# EAGLE design Power_Distro_Board_V6 (EAGLE 8.3.2)
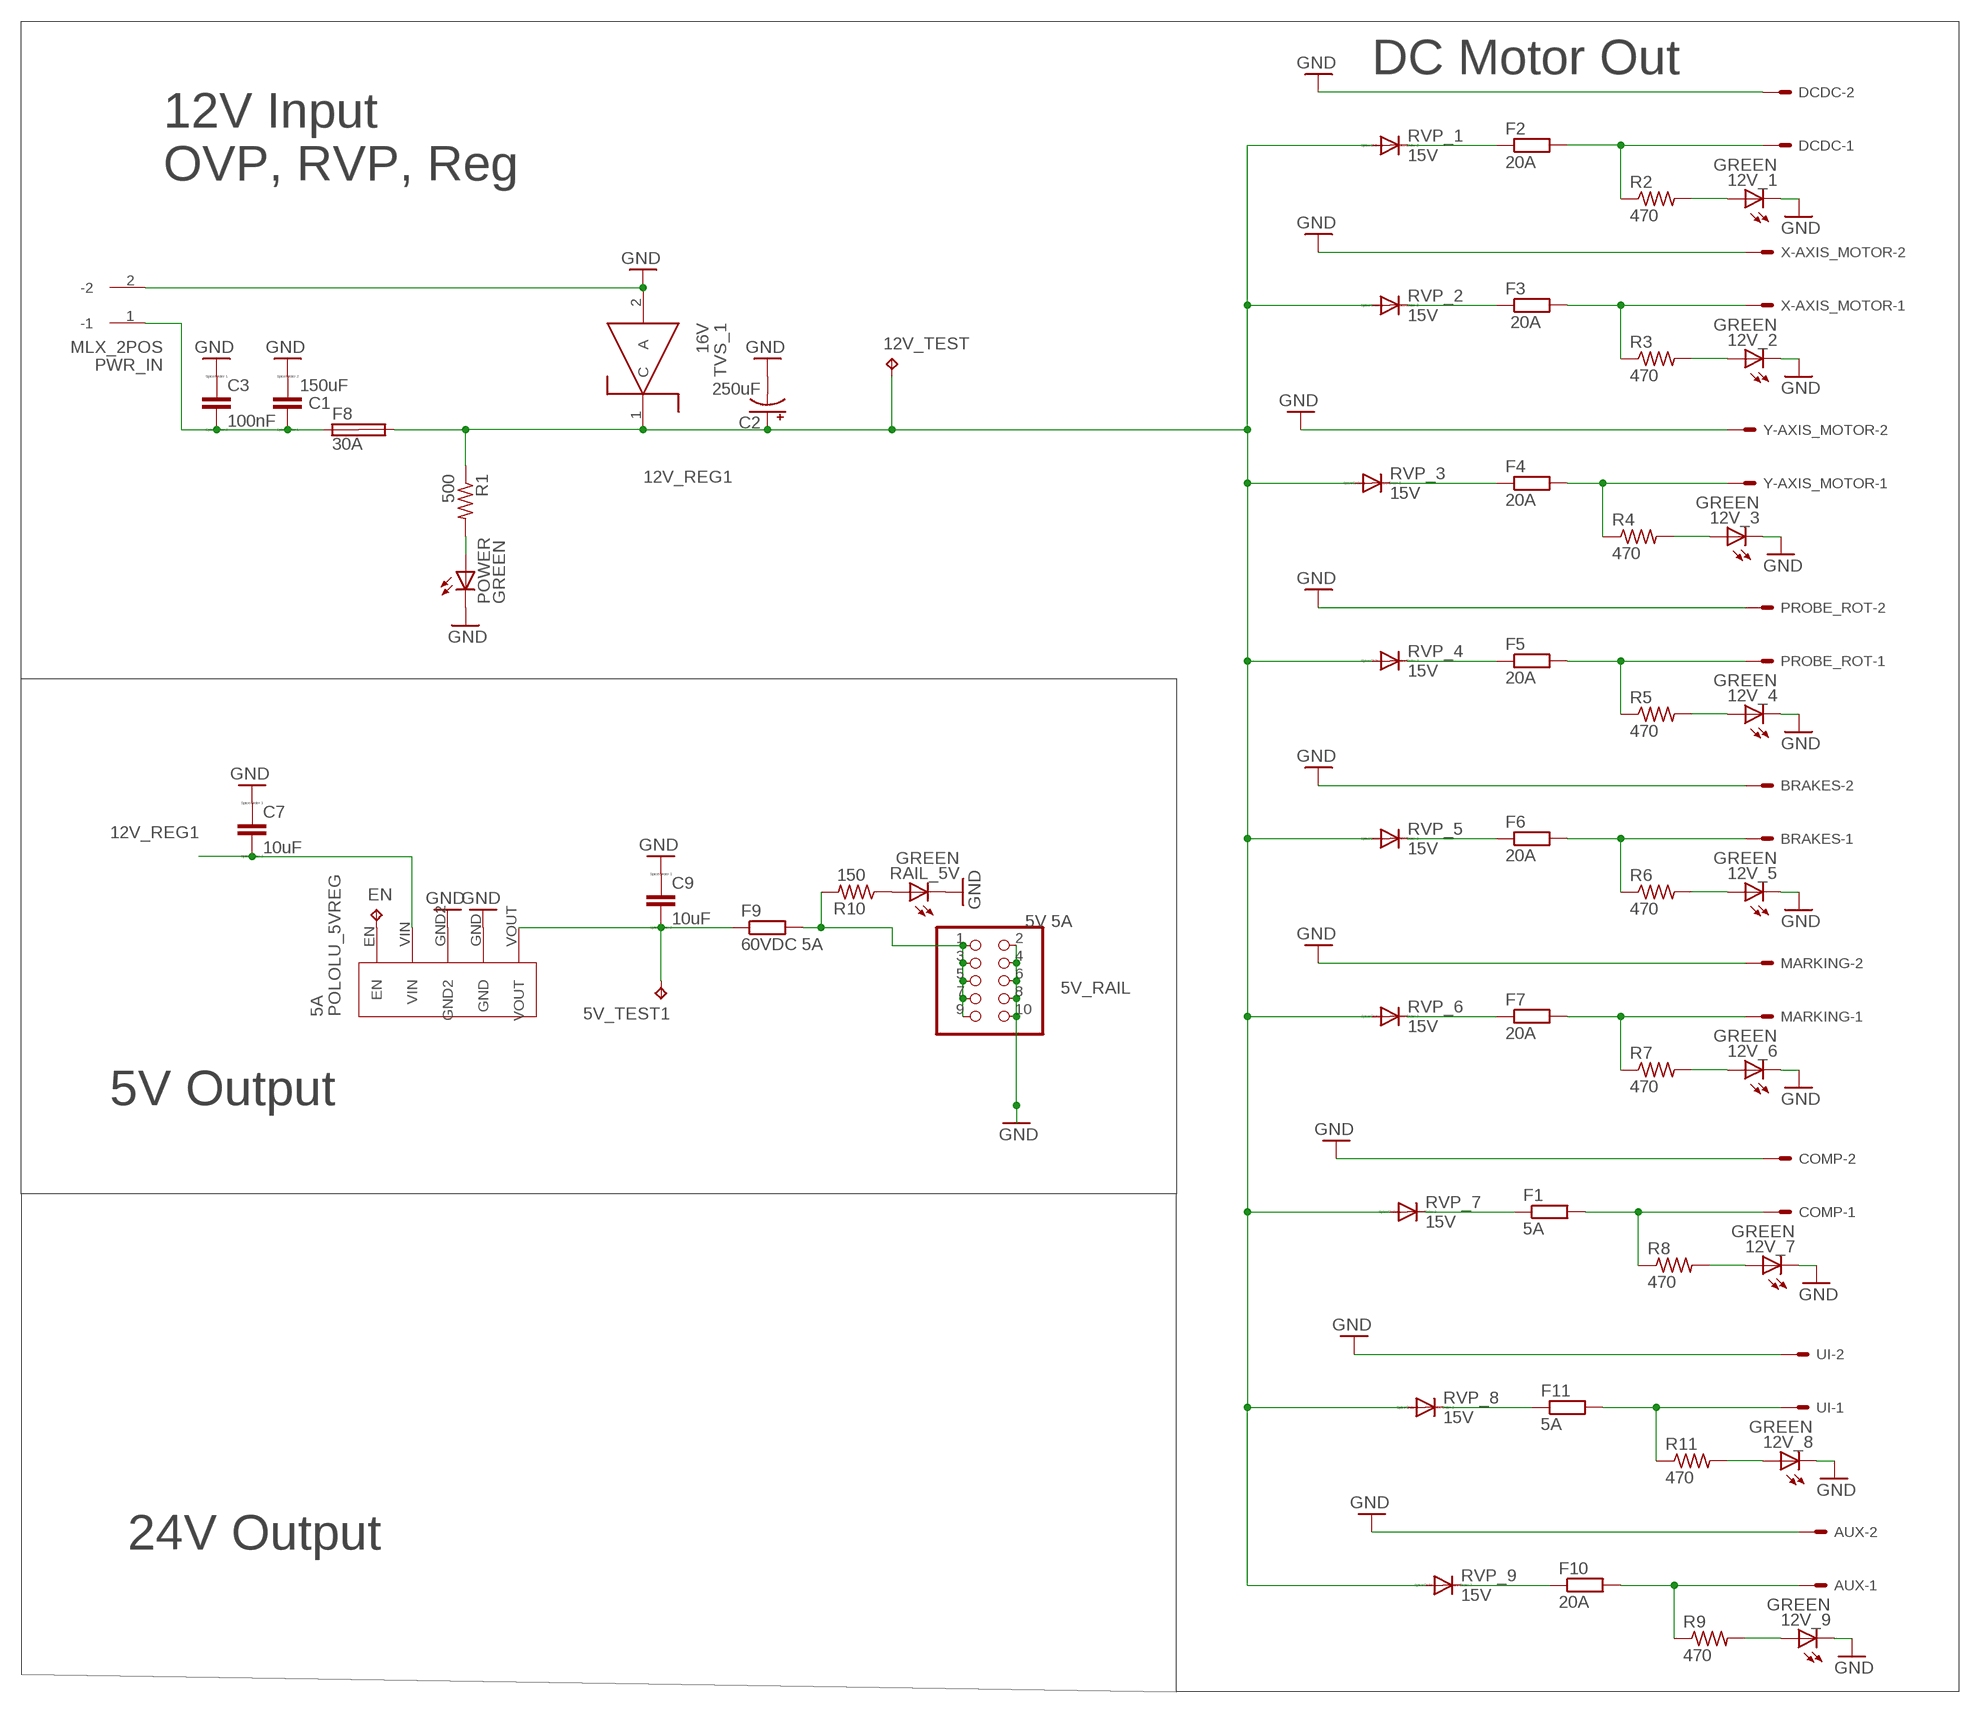
[diagram p0: schematic, sheet 1]

## Parts
5A  POLOLU_5VREG  [SIP5]
5V_RAIL  5V 5A  PINHD-2X5  [2X05]
5V_TEST1  TPPAD1-13  [P1-13]
12V_1  GREEN  LEDSML1206  [SML1206]
12V_2  GREEN  LEDSML1206  [SML1206]
12V_3  GREEN  LEDSML1206  [SML1206]
12V_4  GREEN  LEDSML1206  [SML1206]
12V_5  GREEN  LEDSML1206  [SML1206]
12V_6  GREEN  LEDSML1206  [SML1206]
12V_7  GREEN  LEDSML1206  [SML1206]
12V_8  GREEN  LEDSML1206  [SML1206]
12V_9  GREEN  LEDSML1206  [SML1206]
12V_TEST  TPPAD1-13  [P1-13]
AUX  555X-2V  [5566-2]
BRAKES  555X-2V  [5566-2]
C1  150uF  CC1210  [C1210]
C2  250uF  ALUM_ELEC_RADIAL  [CPOL-RADIAL-5MM-10MM]
C3  100nF  CC1210  [C1210]
C7  10uF  CC1210  [C1210]
C9  10uF  CC1210  [C1210]
COMP  555X-2V  [5566-2]
DCDC  555X-2V  [5566-2]
EN  TPPAD1-13  [P1-13]
F1  5A  R-EU_M1206  [M1206]
F2  20A  R-EU_M1206  [M1206]
F3  20A  R-EU_M1206  [M1206]
F4  20A  R-EU_M1206  [M1206]
F5  20A  R-EU_M1206  [M1206]
F6  20A  R-EU_M1206  [M1206]
F7  20A  R-EU_M1206  [M1206]
F8  30A  SHK20L  [SHK20L]
F9  60VDC 5A  R-EU_M1206  [M1206]
F10  20A  R-EU_M1206  [M1206]
F11  5A  R-EU_M1206  [M1206]
MARKING  555X-2V  [5566-2]
POWER  GREEN  LEDSML1206  [SML1206]
PROBE_ROT  555X-2V  [5566-2]
PWR_IN  MLX_2POS  [.084MLX]
R1  500  R-US_R1206  [R1206]
R2  470  R-US_R1206  [R1206]
R3  470  R-US_R1206  [R1206]
R4  470  R-US_R1206  [R1206]
R5  470  R-US_R1206  [R1206]
R6  470  R-US_R1206  [R1206]
R7  470  R-US_R1206  [R1206]
R8  470  R-US_R1206  [R1206]
R9  470  R-US_R1206  [R1206]
R10  150  R-US_R1206  [R1206]
R11  470  R-US_R1206  [R1206]
RAIL_5V  GREEN  LEDSML1206  [SML1206]
RVP_1  15V  BYT08P  [TO220ACS]
RVP_2  15V  BYT08P  [TO220ACS]
RVP_3  15V  BYT08P  [TO220ACS]
RVP_4  15V  BYT08P  [TO220ACS]
RVP_5  15V  BYT08P  [TO220ACS]
RVP_6  15V  BYT08P  [TO220ACS]
RVP_7  15V  BYT08P  [TO220ACS]
RVP_8  15V  BYT08P  [TO220ACS]
RVP_9  15V  BYT08P  [TO220ACS]
TVS_1  16V  SMAJ26A_TVSSMA  [DO-214AC]
UI  555X-2V  [5566-2]
X-AXIS_MOTOR  555X-2V  [5566-2]
Y-AXIS_MOTOR  555X-2V  [5566-2]

## Nets
5V_REG3: 5V_RAIL.1 5V_RAIL.3 5V_RAIL.5 5V_RAIL.7 5V_RAIL.9 F9.2 R10.2
12V_REG1: 5A.VIN 12V_TEST.TP C2.+ C7.2 F8.2A R1.1 RVP_1.A RVP_2.A RVP_3.A RVP_4.A RVP_5.A RVP_6.A RVP_7.A RVP_8.A RVP_9.A TVS_1.1(C)
GND: 5A.GND 5A.GND2 5V_RAIL.2 5V_RAIL.4 5V_RAIL.6 5V_RAIL.8 5V_RAIL.10 12V_1.C 12V_2.C 12V_3.C 12V_4.C 12V_5.C 12V_6.C 12V_7.C 12V_8.C 12V_9.C AUX.2 BRAKES.2 C1.2 C2.- C3.1 C7.1 C9.1 COMP.2 DCDC.2 MARKING.2 POWER.C PROBE_ROT.2 PWR_IN.2(-2) RAIL_5V.C TVS_1.2(A) UI.2 X-AXIS_MOTOR.2 Y-AXIS_MOTOR.2
N$1: POWER.A R1.2
N$3: C1.1 C3.2 F8.1A PWR_IN.1(-1)
N$4: F1.1 RVP_7.C
N$5: F2.1 RVP_1.C
N$7: F6.1 RVP_5.C
N$8: 5A.EN EN.TP
N$9: 12V_1.A R2.2
N$10: F10.1 RVP_9.C
N$11: R10.1 RAIL_5V.A
N$12: DCDC.1 F2.2 R2.1
N$13: 12V_5.A R6.2
N$14: F3.1 RVP_2.C
N$15: 12V_9.A R9.2
N$16: 12V_2.A R3.2
N$17: BRAKES.1 F6.2 R6.1
N$18: F3.2 R3.1 X-AXIS_MOTOR.1
N$20: F7.1 RVP_6.C
N$21: 12V_6.A R7.2
N$22: F4.1 RVP_3.C
N$23: F7.2 MARKING.1 R7.1
N$24: 12V_3.A R4.2
N$25: F4.2 R4.1 Y-AXIS_MOTOR.1
N$26: F5.1 RVP_4.C
N$27: 12V_4.A R5.2
N$28: F5.2 PROBE_ROT.1 R5.1
N$29: 12V_7.A R8.2
N$30: COMP.1 F1.2 R8.1
N$31: F11.1 RVP_8.C
N$32: 5A.VOUT 5V_TEST1.TP C9.2 F9.1
N$33: 12V_8.A R11.2
N$34: F11.2 R11.1 UI.1
N$35: AUX.1 F10.2 R9.1
Unconnected: F8.1B F8.2B

## Notes on the sheet
- DC Motor Out
- 12V Input 
  OVP, RVP, Reg
- 5V Output
- 24V Output

## Library data of the parts
5A = POWER_DISTRO:POLOLU_5VREG: Pololu 5V Regulator Variable Output Current
5V_RAIL = pinhead:PINHD-2X5: PIN HEADER
5V_TEST1 12V_TEST EN = testpad:TP: Test pad
12V_1-12V_9 POWER RAIL_5V = led:LED: LED OSRAM: - CHIPLED LG R971, LG N971, LY N971, LG Q971, LY Q971, LO R971, LY R971 LH N974, LH R974 LS Q976, LO Q976, LY Q976 LO Q996 - Hyper CHIPLED LW Q18S LB Q993, LB Q99A, LB R99A - SideLED LS A670, LO A670, LY A670, LG A670, LP A670 LB A673, LV A673, LT A673, LW A673 LH A674 LY A675 LS A676, LA A676, LO A676, LY A676, LW A676 LS A679, LY A679, LG A679 - Hyper Micro SIDELED® LS Y876, LA Y876, LO Y876, LY Y876 LT Y87S - SmartLED LW L88C, LW L88S LB L89C, LB L89S, LG L890 LS L89K, LO L89K, LY L89K LS L896, LA L896, LO L896, LY L896 - TOPLED LS T670, LO T670, LY T670, LG T670, LP T670 LSG T670, LSP T670, LSY T670, LOP T670, LYG T670 LG T671, LOG T671, LSG T671 LB T673, LV T673, LT T673, LW T673 LH T674 LS T676, LA T676, LO T676, LY T676, LB T676, LH T676, LSB T676, LW T676 LB T67C, LV T67C, LT T67C, LS T67K, LO T67K, LY T67K, LW E67C LS E67B, LA E67B, LO E67B, LY E67B, LB E67C, LV E67C, LT E67C LW T67C LS T679, LY T679, LG T679 LS T770, LO T770, LY T770, LG T770, LP T770 LB T773, LV T773, LT T773, LW T773 LH T774 LS E675, LA E675, LY E675, LS T675 LS T776, LA T776, LO T776, LY T776, LB T776 LHGB T686 LT T68C, LB T68C - Hyper Mini TOPLED® LB M676 - Mini TOPLED Santana® LG M470 LS M47K, LO M47K, LY M47K Source: http://www.osram.convergy.de LUXEON: - LUMILED® LXK2-PW12-R00, LXK2-PW12-S00, LXK2-PW14-U00, LXK2-PW14-V00 LXK2-PM12-R00, LXK2-PM12-S00, LXK2-PM14-U00 LXK2-PE12-Q00, LXK2-PE12-R00, LXK2-PE12-S00, LXK2-PE14-T00, LXK2-PE14-U00 LXK2-PB12-K00, LXK2-PB12-L00, LXK2-PB12-M00, LXK2-PB14-N00, LXK2-PB14-P00, LXK2-PB14-Q00 LXK2-PR12-L00, LXK2-PR12-M00, LXK2-PR14-Q00, LXK2-PR14-R00 LXK2-PD12-Q00, LXK2-PD12-R00, LXK2-PD12-S00 LXK2-PH12-R00, LXK2-PH12-S00 LXK2-PL12-P00, LXK2-PL12-Q00, LXK2-PL12-R00 Source: www.luxeon.com KINGBRIGHT: KA-3528ASYC Source: www.kingbright.com
AUX BRAKES COMP DCDC MARKING PROBE_ROT UI X-AXIS_MOTOR Y-AXIS_MOTOR = con-molex-2:555X-2: Mini FIT connector 2 way
C1 C3 C7 C9 = eagle-ltspice:C: CAPACITOR, European symbol; SPICEMODEL: NONE; SPICEPREFIX: C
C2 = SparkFun-Capacitors:ALUM_ELEC_RADIAL: 10mm diameter 5mm pitch Alumunum electrolytic capacitor
F1-F7 F9-F11 = resistor:R-EU_: RESISTOR, European symbol
F8 = fuse:SHK20L: FUSE HOLDER 5 x 20 mm, SH contact, SHH1 Schukat, E1073 Buerklin; OC_FARNELL: unknown; OC_NEWARK: unknown
PWR_IN = POWER_DISTRO:MLX_2POS
R1-R11 = resistor:R-US_: RESISTOR, American symbol
RVP_1-RVP_9 = diode:BYT08P: DIODE ultra fast
TVS_1 = POWER_DISTRO:SMAJ26A_TVS: TVS Diode, SMAJ26A

## Net classes
0 default: width 0.025 mm, drill 0.254 mm, clearance 0.254 mm
1 Power IN: width 4.801 mm
2 Motor_OUT: width 4.801 mm
3 3.3V_1A: width 0.305 mm
4 5V_1A: width 0.305 mm
5 12V_2A: width 0.813 mm

## Board
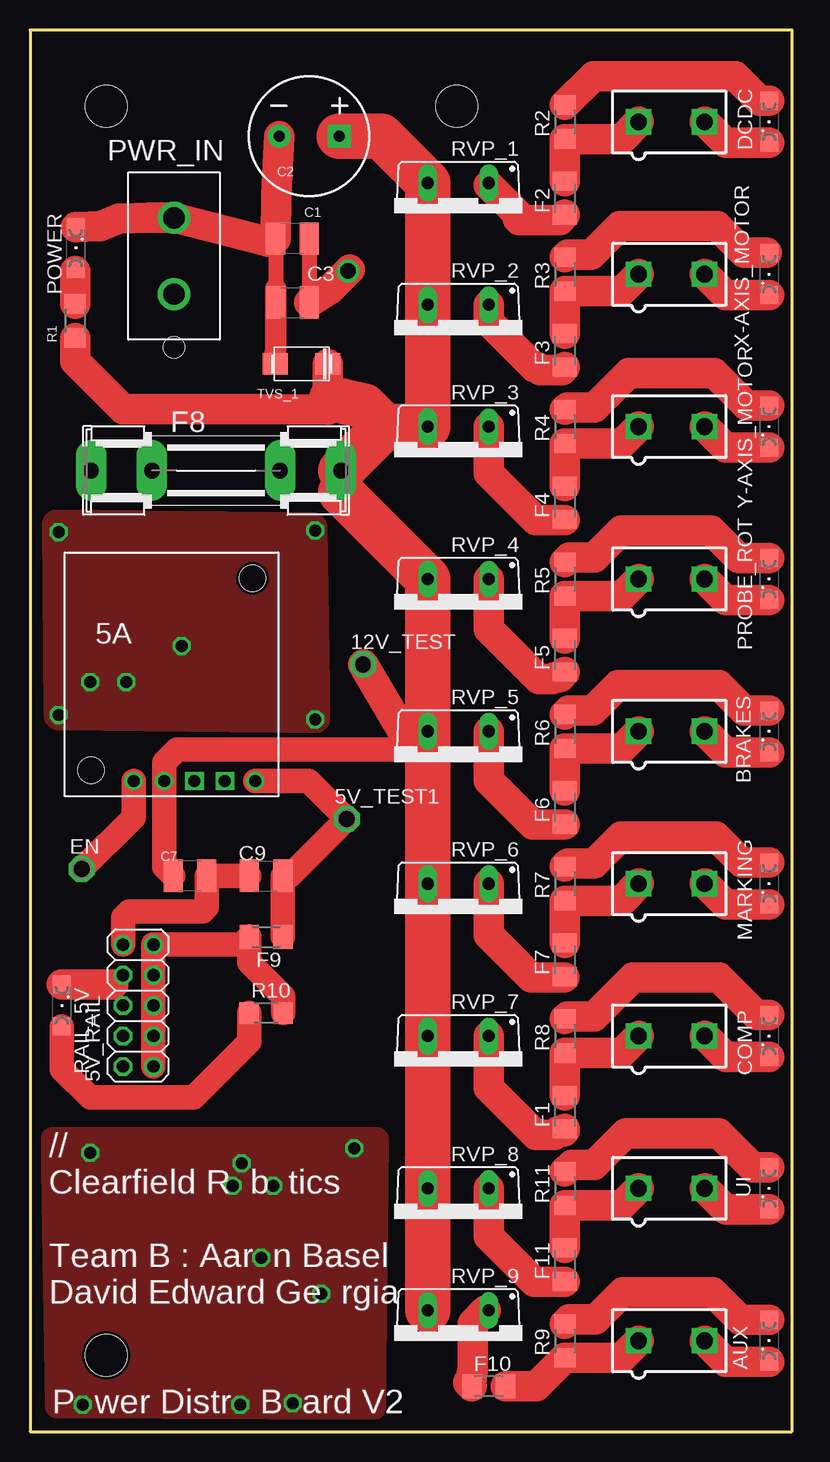
[diagram p1: board, top side]
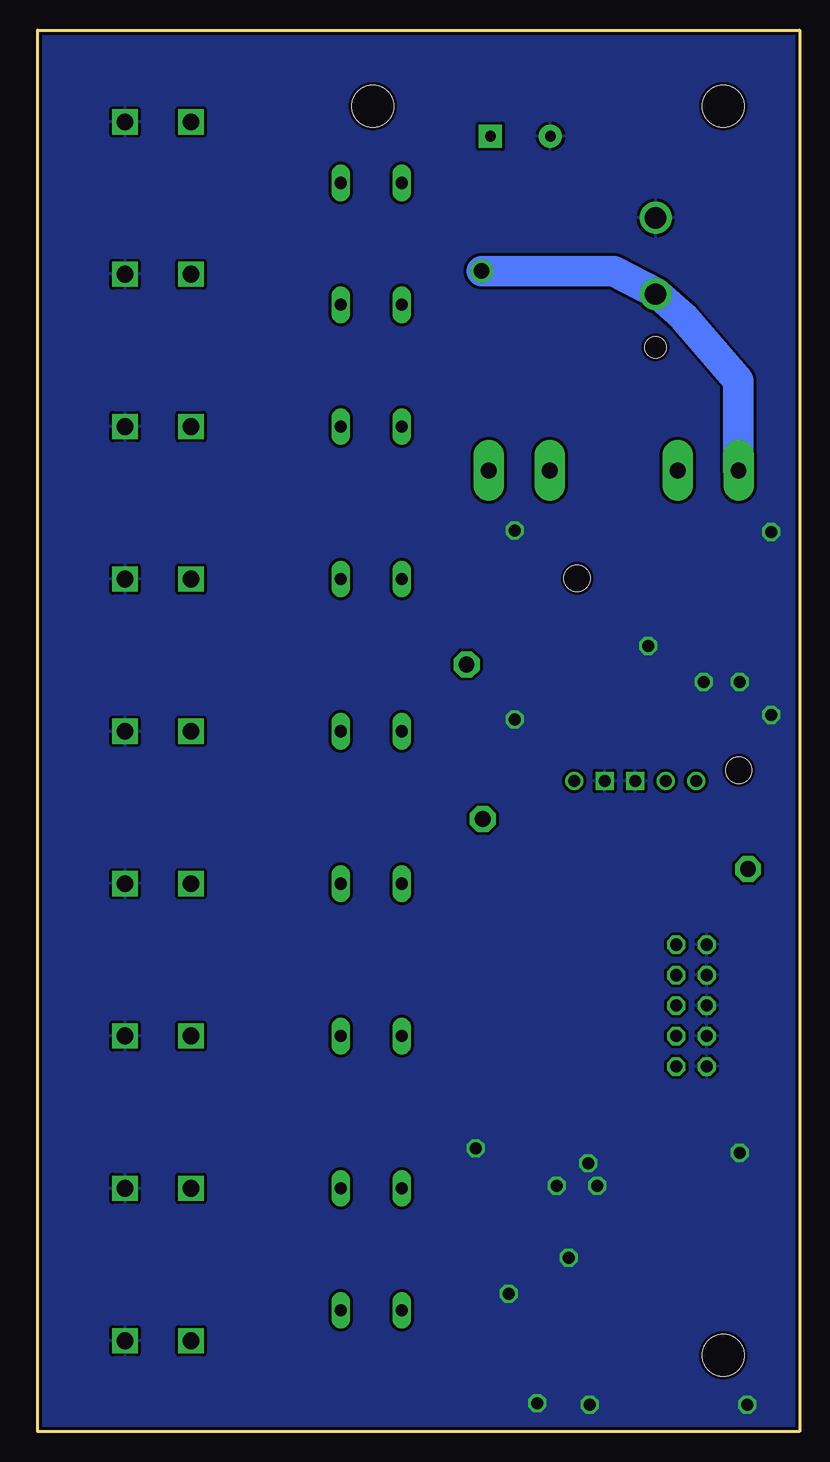
[diagram p2: board, bottom side, seen from below]

Size 63.5 x 116.84 mm. Coordinates in mm from the lower left corner, seen from the top.
Outline: 0,0 63.5,0 63.5,116.84 0,116.84 0,0
Copper layers (1*16): Top 0.035mm / dielectric 1.5mm / Bottom 0.035mm
Design rules "SeeedStudio_2layer_DRU_no_angle_20140221": minimum track width 6mil, minimum drill 12mil, track to track 6mil, track to pad 6mil, pad to pad 6mil, via to via 6mil, smd to smd 0mil, copper to edge 10mil, drill to drill 10mil, minimum pad ring 10mil, minimum via ring 6mil, stop-mask expansion 2mil, vias tented up to drill 100mil, thermal gap 10mil
Holes 3.5 mm at 35.56,110.49 6.35,6.35 6.35,110.49

### Footprints (pad centres in the part's own frame; a part is rotated, then mirrored left to right if it is on the bottom)
SIP5 = drill 1: EN -3.175,-8.89; VIN -0.635,-8.89; VOUT 6.985,-8.89 | drill 1 square: GND 4.445,-8.89; GND2 1.905,-8.89 | hole 2.184: -6.731,-8.001; 6.731,8.001
2X05 = drill 1.016 octagon: 1 -5.08,-1.27; 2 -5.08,1.27; 3 -2.54,-1.27; 4 -2.54,1.27; 5 0,-1.27; 6 0,1.27; 7 2.54,-1.27; 8 2.54,1.27; 9 5.08,-1.27; 10 5.08,1.27
P1-13 = drill 1.321 pad 2.159 octagon: TP 0,0
SML1206 = smd 1.5 x 1.5: A 1.75,0; C -1.75,0
5566-2 = drill 1.4 square: 1 0,-2.75; 2 0,2.75
C1210 = smd 1.6 x 2.7: 1 -1.4,0; 2 1.4,0
CPOL-RADIAL-5MM-10MM = drill 0.9 pad 1.93 square: + 2.5,0 | drill 0.9 pad 1.93: - -2.5,0
M1206 = smd 1.6 x 2: 1 -1.4,0; 2 1.4,0
SHK20L = drill 1.321 pad 2.54 long: 1A -10.414,0; 1B -5.334,0; 2A 10.414,0; 2B 5.334,0
.084MLX = drill 1.778: 1 0,3.175; 2 0,-3.175 | hole 1.778: 0,7.62
R1206 = smd 1.6 x 1.803: 1 -1.422,0; 2 1.422,0
TO220ACS = drill 1.016 long: A 2.54,-2.54; C -2.54,-2.54
DO-214AC = smd 2.083 x 1.778: 1 -2.184,0; 2 2.184,0

### Placement (x,y rotation side)
5A  11.8,63.12 0 top
5V_RAIL  9.02,35.52 90 top
5V_TEST1  26.4,51.06 0 top
12V_1  61.59,109.17 90 top
12V_2  61.59,96.47 90 top
12V_3  61.59,83.78 90 top
12V_4  61.59,71.08 90 top
12V_5  61.59,58.38 90 top
12V_6  61.59,45.67 90 top
12V_7  61.59,32.98 90 top
12V_8  61.59,20.27 90 top
12V_9  61.59,7.58 90 top
12V_TEST  27.75,63.95 0 top
AUX  53.47,7.58 270 top
BRAKES  53.47,58.38 270 top
C1  21.86,99.44 180 top
C2  23.27,107.98 0 top
C3  21.88,94.12 0 top
C7  13.32,46.33 180 top
C9  19.68,46.33 0 top
COMP  53.47,32.98 270 top
DCDC  53.47,109.17 270 top
EN  4.3,46.89 0 top
F1  44.58,26.62 90 top
F2  44.58,102.83 90 top
F3  44.58,90.12 90 top
F4  44.58,77.42 90 top
F5  44.58,64.72 90 top
F6  44.58,52.02 90 top
F7  44.58,39.33 90 top
F8  15.5,80.12 0 top
F9  19.68,41.24 180 top
F10  38.23,3.77 0 top
F11  44.58,13.93 90 top
MARKING  53.47,45.67 270 top
POWER  3.82,98.66 270 top
PROBE_ROT  53.47,71.08 270 top
PWR_IN  12,98 180 top
R1  3.76,92.59 90 top
R2  44.58,109.17 90 top
R3  44.58,96.47 90 top
R4  44.58,83.78 90 top
R5  44.58,71.08 90 top
R6  44.58,58.38 90 top
R7  44.58,45.67 90 top
R8  44.58,32.98 90 top
R9  44.58,7.58 90 top
R10  19.68,34.9 0 top
R11  44.58,20.27 90 top
RAIL_5V  2.67,35.52 270 top
RVP_1  35.69,101.56 180 top
RVP_2  35.69,91.39 180 top
RVP_3  35.69,81.23 180 top
RVP_4  35.69,68.53 180 top
RVP_5  35.69,55.84 180 top
RVP_6  35.69,43.13 180 top
RVP_7  35.69,30.43 180 top
RVP_8  35.69,17.73 180 top
RVP_9  35.69,7.58 180 top
TVS_1  22.64,89 180 top
UI  53.47,20.27 270 top
X-AXIS_MOTOR  53.47,96.47 270 top
Y-AXIS_MOTOR  53.47,83.78 270 top

### Tracks (layer width: path | path; a pad name or v marks a point on that pad's centre or on a via)
5V_REG3
  Top 1.27: 18.25,41.27 F9.2 | 10.29,35.62 10.29,37.75 5V_RAIL.7
  Top 2.032: R10.2 21.1,36.28 18.25,39.12 18.25,41.27 17.57,40.59 5V_RAIL.9 10.29,37.75 5V_RAIL.5 | 5V_RAIL.1 5V_RAIL.3 10.29,35.62
12V_REG1
  Top 1.27: RVP_5.A 31.08,58.38
  Top 2.032: C7.2 11.17,47.08 5A.VIN 11.17,55.79 12.25,56.88 31.64,56.88 RVP_5.A
  Top 2.54: F8.2A 25.91,78.31 | 31.08,58.38 12V_TEST.TP | 24.8,85.2 TVS_1.1 | 24.8,85.2 25.12,86.12 | R1.1 3.76,89.24 7.75,85.25 18.98,85.25 24.8,85.2
  Top 3.81: 29.56,83.78 RVP_3.A RVP_2.A RVP_1.A 29.25,107.98 C2.+ | F8.2A 29.56,83.78 | 25.91,78.31 RVP_4.A RVP_5.A RVP_6.A RVP_7.A RVP_8.A RVP_9.A | 25.12,86.12 27.84,85.5 29.56,83.78
GND  (via drill 1)
  Top 0.508: 12V_1.C 61.59,107.91 61.5,108
  Top 1.27: 5V_RAIL.10 | 6.96,37.27 5V_RAIL.8 | C1.2 20.46,95.27
  Top 1.778: 19.82,99.17 C1.2 | 20.46,95.27 C3.1 20.48,91.27 TVS_1.2
  Top 2.032: C9.1 C7.1 14.72,43.73 14.38,43.38 8.25,43.38 7.75,42.88 5V_RAIL.10
  Top 2.54: 12V_9.C 57.97,5.83 AUX.2 | 12V_8.C 57.97,18.52 UI.2 | 12V_7.C 57.97,31.23 COMP.2 | 12V_6.C 57.97,43.92 MARKING.2 | 12V_5.C 57.97,56.62 BRAKES.2 | 12V_4.C 57.97,69.33 PROBE_ROT.2 | 12V_3.C 57.97,82.03 Y-AXIS_MOTOR.2 | 12V_2.C 57.97,94.72 X-AXIS_MOTOR.2 | 12V_1.C 57.97,107.42 DCDC.2 | RAIL_5V.C 6.96,37.27 | POWER.C 5.86,100.5 7.38,101.12 9.95,101.17 PWR_IN.2 19.82,99.17 | C2.- 20.52,103.12 C1.2
  other vias: 4.38,2.25 17.5,2.25 21.88,2.38 24.25,11.5 19.25,14.5 16.88,20.5 20.25,20.5 2.38,75 2.38,59.75 5,62.5 8,62.5 12.62,65.5 23.75,59.38 23.75,75.12 5,23.25 17.62,22.38 27,23.62
  pour Bottom: 0,117 63.88,117 63.88,-0.5 0,-0.5
  pour Top: 2.25,75.62 2.38,59.75 23.75,59.5 23.5,75.38
  pour Top: 1.88,24.38 2.25,2.12 28.62,2 28.88,24.38
N$1
  Top 1.27: 3.76,96.73 POWER.A
  Top 2.54: R1.2 3.76,96.73
N$3  (via drill 1.27)
  Top 1.27: C3.2 23.27,99.81 C1.1
  Top 2.54: C3.2 25,95.25 v26.5,96.75 26.62,96.88
  Bottom 2.54: v26.5,96.75 15.5,96.75 11.88,94.88 | 11.88,94.88 9.75,93 5.12,87.62 5.12,80.16 F8.1A | PWR_IN.1 11.8,94.83 11.88,94.88
N$4
  Top 1.27: F1.1 44.55,25.25
  Top 2.54: RVP_7.C 38.23,28.65 42.12,24.75 43.68,24.75 43.97,25.04 44.5,25.04 44.58,25.12 F1.1
N$5
  Top 1.27: RVP_1.C 38.23,103.9 | 44.5,101.5 F2.1
  Top 2.54: 38.23,103.9 40.62,101.5 40.62,101.12 40.75,101 44.15,101 F2.1
N$7
  Top 2.54: RVP_5.C 38.23,54.27 41.88,50.62 F6.1
N$8
  Top 2.032: 5A.EN 8.63,51.22 EN.TP
N$9
  Top 2.54: 44.9,110.92 R2.2 46.98,113 58.75,113 60.83,110.92 12V_1.A
N$10
  Top 1.27: RVP_9.C 37.99,10.12 | 36.88,3.81 F10.1
  Top 2.54: 37.99,10.12 36.88,9 36.88,4.97 36.83,4.92 36.83,4.46 36.5,4.12 36.5,4.09 F10.1
N$11
  Top 1.27: R10.1
  Top 2.032: RAIL_5V.A 2.67,30.21 5,27.88 13.62,27.88 18.25,32.5 R10.1
N$12
  Top 2.54: DCDC.1 49.29,107.75 R2.1 F2.2
N$13
  Top 2.54: R6.2 44.9,60.12 46.88,60.12 49,62.25 57.38,62.25 59.5,60.12 12V_5.A
N$14
  Top 1.27: 44.55,88.75 F3.1
  Top 2.54: RVP_2.C 38.23,92.53 42,88.75 42.25,88.75 42.5,88.5 44.35,88.5 F3.1
N$15
  Top 0.508: 44.9,9.32 R9.2
  Top 2.54: R9.2 44.95,9.38 47.12,9.38 49.38,11.62 56.88,11.62 59.17,9.32 12V_9.A
N$16
  Top 0.508: 44.57,98.27 R3.2 | 61.4,98.28 12V_2.A
  Top 2.54: R3.2 44.8,98.12 46.75,98.12 49.12,100.5 57.25,100.5 59.47,98.28 61.4,98.28
N$17
  Top 2.54: BRAKES.1 49.29,56.95 R6.1 F6.2
N$18
  Top 2.54: X-AXIS_MOTOR.1 49.29,95.05 R3.1 F3.2
N$20
  Top 1.27: 44.52,37.88 F7.1
  Top 2.54: RVP_6.C 38.23,41.4 41.75,37.88 44.52,37.88
N$21
  Top 0.508: 44.9,47.42 R7.2
  Top 2.54: R7.2 44.85,47.38 47,47.38 49.25,49.62 57.12,49.62 59.33,47.42 12V_6.A
N$22
  Top 1.27: 44.55,76 F4.1
  Top 2.54: RVP_3.C 38.23,79.9 42.12,76 44.55,76
N$23
  Top 2.54: MARKING.1 49.29,44.25 R7.1 F7.2
N$24
  Top 0.508: 44.9,85.53 R4.2
  Top 2.54: R4.2 44.75,85.38 47,85.38 49.88,88.25 57,88.25 59.73,85.53 12V_3.A
N$25
  Top 2.54: Y-AXIS_MOTOR.1 49.29,82.35 R4.1 F4.2
N$26
  Top 1.27: 44.52,63.38 F5.1
  Top 2.54: RVP_4.C 38.23,66.9 42.38,62.75 43.58,62.75 43.75,62.92 44.17,62.92 F5.1
N$27
  Top 0.508: 44.9,72.83 R5.2
  Top 2.54: R5.2 44.95,72.88 47,72.88 49.25,75.12 56.75,75.12 59.05,72.83 12V_4.A
N$28
  Top 2.54: PROBE_ROT.1 49.29,69.65 R5.1 F5.2
N$29
  Top 0.508: 44.9,34.73 R8.2
  Top 2.54: R8.2 44.8,34.62 47,34.62 50.25,37.88 57.38,37.88 60.52,34.73 12V_7.A
N$30
  Top 2.54: COMP.1 49.29,31.55 R8.1 F1.2
N$31
  Top 1.27: 44.55,12.5 F11.1
  Top 2.54: RVP_8.C 38.23,16.27 42,12.5 44.55,12.5
N$32
  Top 1.27: 21.66,46.33 C9.2
  Top 2.032: 21.66,46.33 5V_TEST1.TP 23.23,54.23 5A.VOUT | C9.2 F9.1
N$33
  Top 0.508: 44.9,22.02 R11.2
  Top 2.54: R11.2 45.13,22.25 47,22.25 49.62,24.88 57.38,24.88 60.23,22.02 12V_8.A
N$34
  Top 2.54: UI.1 49.29,18.85 R11.1 F11.2
N$35
  Top 2.54: AUX.1 49.29,6.15 R9.1 42.19,3.77 F10.2

### Text on the board
tNames: // / Clearfield R b tics / / Team B : Aar n Basel / David Edward Ge rgia | P wer Distr B ard V2